# Altium schematic sheet SDCI_Converter.SchDoc: Shutdown Circuit Indicator
size A4; CheckedBy: Nico Bieberich; Author: Nico Bieberich; Organization: Baltic Racing; Address1: Zur Schwedenschanze 15; Address2: Haus 18; Address3: 18435 Stralsund; Revision: xx.xx; SheetNumber: 4; SheetTotal: 6; Rules: LVS; ProjectName: Projekt
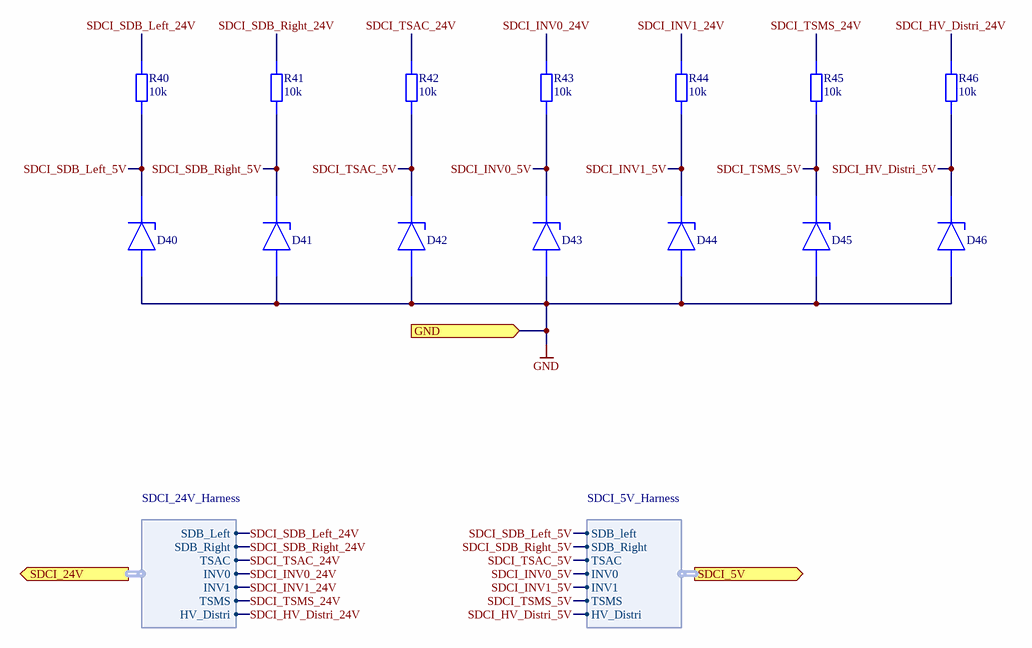
[diagram p0: SDCI_Converter.SchDoc]

## Parts
D40  MM3Z4V7T1G  [SOD-323-2]  (value not drawn)
D41  MM3Z4V7T1G  [SOD-323-2]  (value not drawn)
D42  MM3Z4V7T1G  [SOD-323-2]  (value not drawn)
D43  MM3Z4V7T1G  [SOD-323-2]  (value not drawn)
D44  MM3Z4V7T1G  [SOD-323-2]  (value not drawn)
D45  MM3Z4V7T1G  [SOD-323-2]  (value not drawn)
D46  MM3Z4V7T1G  [SOD-323-2]  (value not drawn)
R40  value 10k  [STACKPOLE CSR0603]  (hidden comment: SMD Resistor)
R41  value 10k  [STACKPOLE CSR0603]  (hidden comment: SMD Resistor)
R42  value 10k  [STACKPOLE CSR0603]  (hidden comment: SMD Resistor)
R43  value 10k  [STACKPOLE CSR0603]  (hidden comment: SMD Resistor)
R44  value 10k  [STACKPOLE CSR0603]  (hidden comment: SMD Resistor)
R45  value 10k  [STACKPOLE CSR0603]  (hidden comment: SMD Resistor)
R46  value 10k  [STACKPOLE CSR0603]  (hidden comment: SMD Resistor)

## Ports
GND (in), SDCI_5V (out, harness SDCI_5V_Harness), SDCI_24V (out, harness SDCI_24V_Harness)

## Harnesses
SDCI_5V_Harness: SDB_left, SDB_Right, TSAC, INV0, INV1, TSMS, HV_Distri
SDCI_24V_Harness: SDB_Left, SDB_Right, TSAC, INV0, INV1, TSMS, HV_Distri

## Nets
GND: D40.2A(A) D41.2A(A) D42.2A(A) D43.2A(A) D44.2A(A) D45.2A(A) D46.2A(A) ; port GND
SDCI_HV_Distri_5V: D46.1C(C) R46.1 ; port SDCI_5V.HV_Distri
SDCI_HV_Distri_24V: R46.2 ; port SDCI_24V.HV_Distri
SDCI_INV0_5V: D43.1C(C) R43.1 ; port SDCI_5V.INV0
SDCI_INV0_24V: R43.2 ; port SDCI_24V.INV0
SDCI_INV1_5V: D44.1C(C) R44.1 ; port SDCI_5V.INV1
SDCI_INV1_24V: R44.2 ; port SDCI_24V.INV1
SDCI_SDB_Left_5V: D40.1C(C) R40.1 ; port SDCI_5V.SDB_left
SDCI_SDB_Left_24V: R40.2 ; port SDCI_24V.SDB_Left
SDCI_SDB_Right_5V: D41.1C(C) R41.1 ; port SDCI_5V.SDB_Right
SDCI_SDB_Right_24V: R41.2 ; port SDCI_24V.SDB_Right
SDCI_TSAC_5V: D42.1C(C) R42.1 ; port SDCI_5V.TSAC
SDCI_TSAC_24V: R42.2 ; port SDCI_24V.TSAC
SDCI_TSMS_5V: D45.1C(C) R45.1 ; port SDCI_5V.TSMS
SDCI_TSMS_24V: R45.2 ; port SDCI_24V.TSMS

## Notes on the sheet
- Title:
- Projekt:
- Revision:
- Author:
- Rules:
- Checked by:
- Sheet
- of
- Size:
- A4
- Date:
- Time:

## Library data of the parts
D40-D46 = MM3Z4V7T1G: onsemi MM3Z4V7T1G / Z-Diode, 4,7V; ComponentLink1Description: Octopart; ComponentLink1URL: https://octopart.com/mm3z4v7t1g-onsemi-331144?r=sp
R40-R46 = SMD Resistor: Resistor with multiple footprints; Power: 0.1W